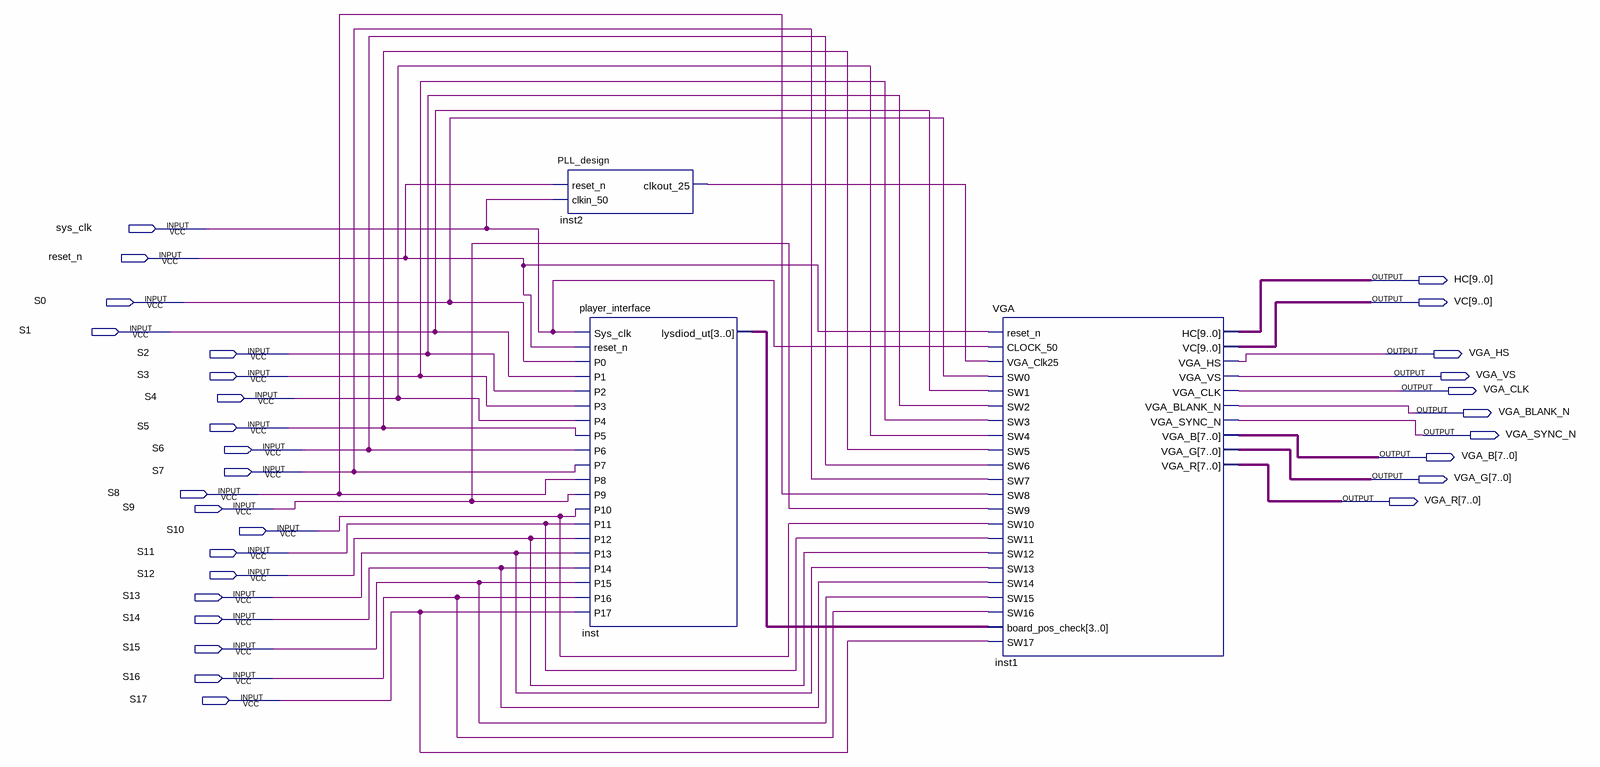
[diagram p0: schematic sheet]
// Quartus schematic VHDL_Engineering_Job.bdf as structural Verilog: 3 symbols, 30 pins
module VHDL_Engineering_Job (
  input  sys_clk,
  input  reset_n,
  input  S0,
  input  S1,
  input  S2,
  input  S3,
  input  S4,
  input  S5,
  input  S6,
  input  S7,
  input  S8,
  input  S9,
  input  S10,
  input  S11,
  input  S12,
  input  S13,
  input  S14,
  input  S15,
  input  S16,
  input  S17,
  output [9:0] HC,
  output [9:0] VC,
  output VGA_HS,
  output VGA_VS,
  output VGA_CLK,
  output VGA_BLANK_N,
  output VGA_SYNC_N,
  output [7:0] VGA_B,
  output [7:0] VGA_G,
  output [7:0] VGA_R
);

  wire inst2_clkout_25;
  wire [3:0] inst_lysdiod_ut;

  PLL_design inst2 (.reset_n(reset_n), .clkin_50(sys_clk), .clkout_25(inst2_clkout_25));
  player_interface inst (
    .Sys_clk(sys_clk), .reset_n(reset_n), .P0(S0), .P1(S1), .P2(S2), .P3(S3), .P4(S4), .P5(S5), .P6(S6),
    .P7(S7), .P8(S8), .P9(S9), .P10(S10), .P11(S11), .P12(S12), .P13(S13), .P14(S14), .P15(S15), .P16(S16),
    .P17(S17), .lysdiod_ut(inst_lysdiod_ut));
  VGA inst1 (
    .reset_n(reset_n), .CLOCK_50(sys_clk), .VGA_Clk25(inst2_clkout_25), .SW0(S0), .SW1(S1), .SW2(S2),
    .SW3(S3), .SW4(S4), .SW5(S5), .SW6(S6), .SW7(S7), .SW8(S8), .SW9(S9), .SW10(S10), .SW11(S11), .SW12(S12),
    .SW13(S13), .SW14(S14), .SW15(S15), .SW16(S16), .board_pos_check(inst_lysdiod_ut), .SW17(S17), .HC(HC),
    .VC(VC), .VGA_HS(VGA_HS), .VGA_VS(VGA_VS), .VGA_CLK(VGA_CLK), .VGA_BLANK_N(VGA_BLANK_N),
    .VGA_SYNC_N(VGA_SYNC_N), .VGA_B(VGA_B), .VGA_G(VGA_G), .VGA_R(VGA_R));
endmodule
